# EAGLE design led-cc-driver-mk-2.0 (EAGLE 6.5.0)
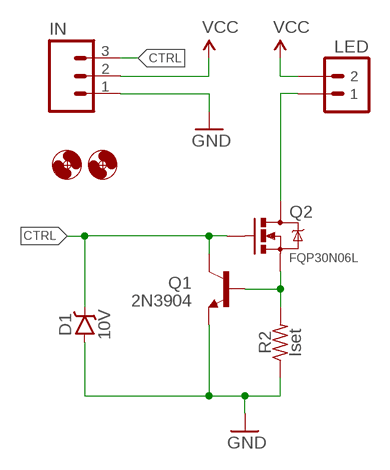
[diagram p0: schematic, sheet 1]

## Parts
D1  10V  DIODE-ZENER7.62MM-PTH  [DIODE-ZENNER-7.62MM]
H1  HOLE#2  [HOLE-#2]
H2  HOLE#2  [HOLE-#2]
IN  M03PTH  [1X03]
LED  M02PTH  [1X02]
Q1  2N3904  TRANSISTOR_NPNTO-92-AMMO-EBC  [TO-92-AMMO]
Q2  FQP30N06L  MOSFET-NCHANNELTO-220  [TO220-THERMPAD]
R2  Iset  RESISTORPTH-AXIAL-10.16MM  [RESISTOR-AXIAL-PTH-10.16MM]

## Nets
CTRL: D1.K(C) IN.3 Q1.3(C) Q2.1(G)
GND: D1.A IN.1 Q1.1(E) R2.P$1
N$1: Q1.2(B) Q2.3(S) R2.P$2
N$4: LED.1 Q2.2@1(D) Q2.2@2(D)
VCC: IN.2 LED.2

## Library data of the parts
D1 = A_butts:DIODE-ZENER: Zener Diode Production Part - 8199 3.4V Zener Voltage
H1 H2 = A_butts:HOLE: MOUNTING HOLE with drill center marker
IN = A_butts:M03: Header 3 Standard 3-pin 0.1" header. Use with straight break away headers (SKU : PRT-00116), right angle break away headers (PRT-00553), swiss pins (PRT-00743), machine pins (PRT-00117), and female headers (PRT-00115). Molex polarized connector foot print use with SKU : PRT-08232 with associated crimp pins and housings.
LED = A_butts:M02: Standard 2-pin 0.1" header. Use with - straight break away headers ( PRT-00116) - right angle break away headers (PRT-00553) - swiss pins (PRT-00743) - machine pins (PRT-00117) - female headers (PRT-00115) Molex polarized connector foot print use with: PRT-08233 with associated crimp pins and housings. 2.54_SCREWTERM for use with PRT-10571. 3.5mm Screw Terminal footprints for PRT-08084 5mm Screw Terminal footprints for use with PRT-08433
Q1 = A_butts:TRANSISTOR_NPN: Generic NPN BJT MMBT2222A - TRANS-08049 (SOT-23, 1A 40V) MPSA42 - TRANS-09116 (SOT-23, 500mA 300V) MMBT5088LT1G - TRANS-11160 (SOT-23, 50 mA 30V) BC547 - COM-08928 <http://www.sparkfun.com/products/8928> (TO-92 45V 100mA) (1.Collector 2.Base 3.Emitter) 2N3904 - COM-00521 <http://www.sparkfun.com/products/521> (TO-92 40V 200mA) (1.Emitter 2.Base 3.Collector) P2N2222A - COM-12852 <http://www.sparkfun.com/products/12852> (TO-92 40V 600mA) (1.Collector 2.Base 3.Emitter)
Q2 = A_butts:MOSFET-NCHANNEL: Common NMOSFET Parts MFG P/N Store ID Prod ID FDD8780 TRANS-09984 SI7820DN TRANS-11055 FDS6630A IC-08089 2N7002PW TRANS-11151 FQP30N06L COM-10213 TRANS-10060 BSS123LT1G TRANS-08345 BSS138 TRANS-00830 BS170 2N7000
R2 = A_butts:RESISTOR: RESISTOR, American symbol

## Board
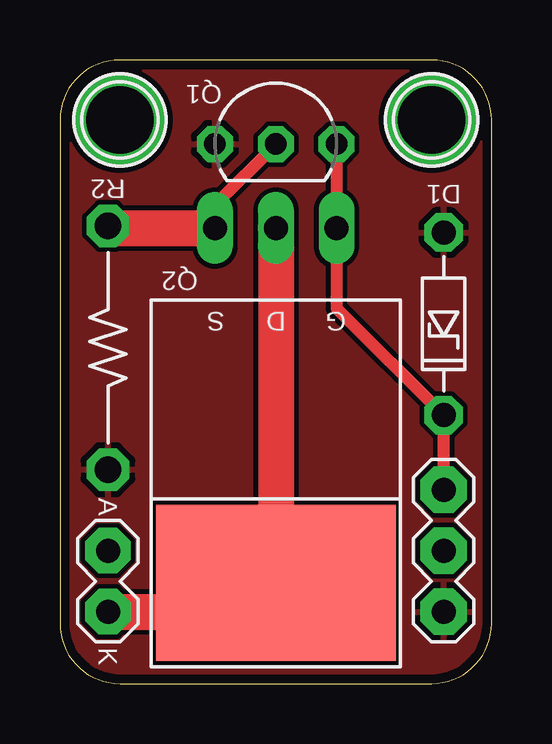
[diagram p1: board, top side]
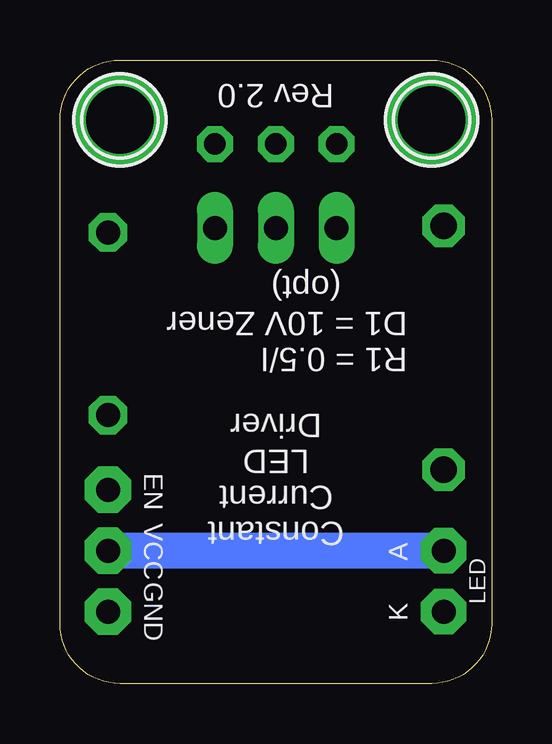
[diagram p2: board, bottom side, seen from below]

Size 18 x 26 mm. Coordinates in mm from the lower left corner, seen from the top.
Outline: 0,23.5 0,2.5 arc90 2.5,0 15.5,0 arc90 18,2.5 18,23.5 arc90 15.5,26 2.5,26 arc90 0,23.5
Copper layers (1*16): Top 0.0356mm / dielectric 1.5011mm / Bottom 0.0356mm
Design rules "LaenPCBOrder2": minimum track width 6mil, minimum drill 13mil, track to track 6mil, track to pad 6mil, pad to pad 6mil, via to via 6mil, smd to smd 6mil, copper to edge 15mil, drill to drill 6mil, minimum pad ring 7mil, minimum via ring 7mil, stop-mask expansion 3mil, vias tented up to drill 20mil, thermal gap 10mil

### Footprints (pad centres in the part's own frame; a part is rotated, then mirrored left to right if it is on the bottom)
DIODE-ZENNER-7.62MM = drill 1 pad 1.6 octagon: A -3.81,0; K 3.81,0
HOLE-#2 = drill 2.8 pad 3.81: P$1 0,0
1X03 = drill 1 pad 1.93 octagon: 1 0,0; 2 2.54,0; 3 5.08,0
1X02 = drill 1 pad 1.88 octagon: 1 0,0; 2 2.54,0
TO-92-AMMO = drill 0.9 pad 1.5 octagon: 1 -2.54,0; 2 0,0; 3 2.54,0
TO220-THERMPAD = drill 1 long: 1 -2.54,0; 2@2 0,0; 3 2.54,0 | smd 10 x 6.5: 2@1 0,14.81
RESISTOR-AXIAL-PTH-10.16MM = drill 1.1 pad 1.778 octagon: P$1 -5.08,0; P$2 5.08,0

### Placement (x,y rotation side)
D1  16,15 270 top
H1  2.5,23.5 0 top
H2  15.5,23.5 0 top
IN  16,3 90 top
LED  2,3 90 top
Q1  9,22.5 0 top
Q2  9,19 180 top
R2  2,14 90 top

### Tracks (layer width: path | path; a pad name or v marks a point on that pad's centre or on a via)
CTRL
  Top 0.5: Q1.3 Q2.1 11.54,15.65 D1.K IN.3
GND
  pour Top (isolate 0.2): 15.5,0 2.5,0 arc-90 0,2.5 0,23.5 arc-90 2.5,26 15.5,26 arc-90 18,23.5 18,2.5 arc-90
N$1
  Top 0.5: Q2.3 6.46,19.96 Q1.2
  Top 1.5: R2.P$2 2.08,19 Q2.3
N$4
  Top 0.8: 7.81,3 Q2.2@1
  Top 1.5: LED.1 7.81,3 | Q2.2@2 Q2.2@1
VCC
  Bottom 1.5: LED.2 IN.2

### Text on the board
tPlace: S | D | G | A | K
bPlace: R1 = 0.5/I / D1 = 10V Zener / (opt) | Constant / Current / LED / Driver | EN | A | VCC | K | GND